# EAGLE schematic MegaShield_v0.6 (EAGLE 6.4)
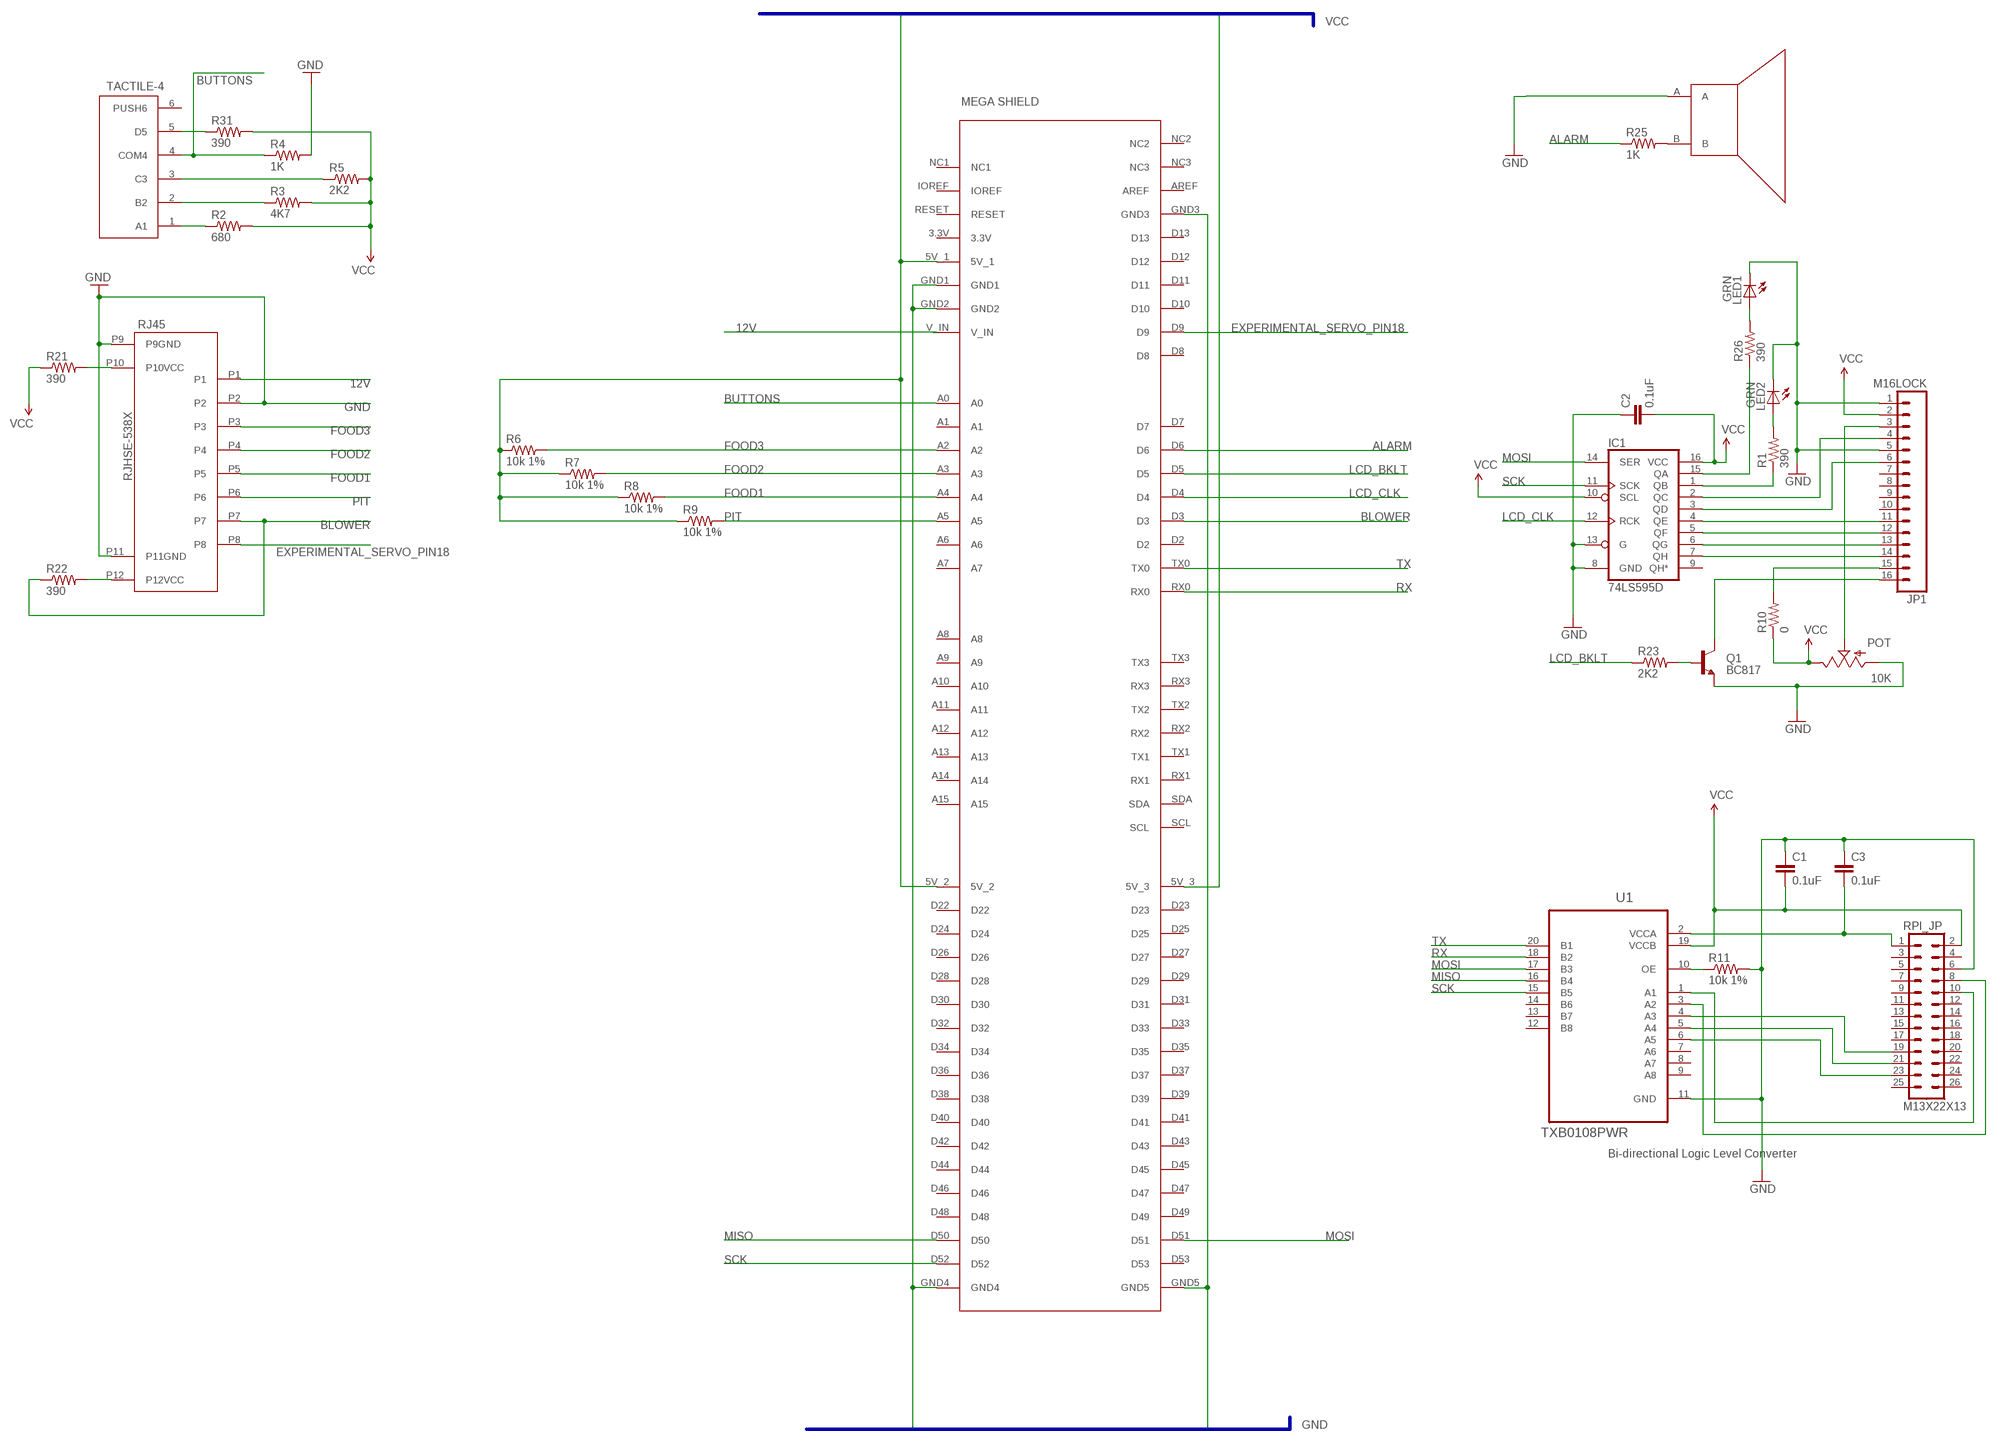
[diagram p0: schematic, sheet 1]

## Parts
C1  0.1uF  CAP0805  [0805]
C2  0.1uF  CAP0805  [0805]
C3  0.1uF  CAP0805  [0805]
IC1  74LS595D  [SO16]
JP1  M16LOCK  [1X16_LOCK]
LED1  GRN  LED5MM  [LED5MM]
LED2  GRN  LED5MM  [LED5MM]
POT  10K  POT100K_3362U  [3362U]
Q1  BC817  TRANSISTOR_NPNSOT23  [SOT23]
R1  390  RESISTOR0805-RES  [0805]
R2  680  RESISTOR0805-RES  [0805]
R3  4K7  RESISTOR0805-RES  [0805]
R4  1K  RESISTOR0805-RES  [0805]
R5  2K2  RESISTOR0805-RES  [0805]
R6  10k 1%  RESISTOR0805-RES  [0805]
R7  10k 1%  RESISTOR0805-RES  [0805]
R8  10k 1%  RESISTOR0805-RES  [0805]
R9  10k 1%  RESISTOR0805-RES  [0805]
R10  0  RESISTOR0805-RES  [0805]
R11  10k 1%  RESISTOR0805-RES  [0805]
R21  390  RESISTOR0805-RES  [0805]
R22  390  RESISTOR0805-RES  [0805]
R23  2K2  RESISTOR0805-RES  [0805]
R25  1K  RESISTOR0805-RES  [0805]
R26  390  RESISTOR0805-RES  [0805]
R31  390  RESISTOR0805-RES  [0805]
RJHSE-538X  RJHSE-338X  [RJHSE-538X]
RPI_JP  M13X22X13  [2X13]
TACTILE-4  SKQUAAA010  [SKQUAAA010]
U1  TXB0108PWR  [SOP65P640X120-20N]
U$1  MEGASHILED  [MEGASHIELD]
U$4  PS1240P02BT  [PS1240P02BT]

## Nets
3.3V_PI: C3.2 RPI_JP.1 U1.2(VCCA)
12V: RJHSE-538X.P1 U$1.V_IN
ALARM: R25.1 U$1.D6
BLOWER: R22.1 RJHSE-538X.P7 U$1.D3
BUTTONS: R4.1 TACTILE-4.4(COM4) U$1.A0
EXPERIMENTAL_SERVO_PIN18: RJHSE-538X.P8 U$1.D9
FOOD1: R8.2 RJHSE-538X.P5 U$1.A4
FOOD2: R7.2 RJHSE-538X.P4 U$1.A3
FOOD3: R6.2 RJHSE-538X.P3 U$1.A2
GND: C1.1 C2.1 C3.1 IC1.8(GND) IC1.13(G) JP1.1 JP1.5 LED1.K(C) LED2.K(C) POT.P$3(A) Q1.2(E) R4.2 R11.2 RJHSE-538X.P2 RJHSE-538X.P9(P9GND) RJHSE-538X.P11(P11GND) RPI_JP.6 U1.11(GND) U$1.GND1 U$1.GND2 U$1.GND3 U$1.GND4 U$1.GND5 U$4.A
LCD_BKLT: R23.1 U$1.D5
LCD_CLK: IC1.12(RCK) U$1.D4
MISO: U1.16(B4) U$1.D50
MOSI: IC1.14(SER) U1.17(B3) U$1.D51
N$1: R22.2 RJHSE-538X.P12(P12VCC)
N$2: R21.2 RJHSE-538X.P10(P10VCC)
N$3: R25.2 U$4.B
N$4: LED2.A R1.2
N$5: IC1.7(QH) JP1.14
N$6: IC1.6(QG) JP1.13
N$7: IC1.5(QF) JP1.12
N$8: R2.1 TACTILE-4.1(A1)
N$9: R3.1 TACTILE-4.2(B2)
N$10: R5.1 TACTILE-4.3(C3)
N$11: R31.1 TACTILE-4.5(D5)
N$12: IC1.4(QE) JP1.11
N$13: IC1.3(QD) JP1.6
N$14: IC1.2(QC) JP1.4
N$15: JP1.15 R10.2
N$16: LED1.A R26.2
N$17: JP1.16 Q1.3(C)
N$18: RPI_JP.10 U1.1(A1)
N$19: JP1.3 POT.P$2(S)
N$21: IC1.15(QA) R26.1
N$22: IC1.1(QB) R1.1
N$23: Q1.1(B) R23.2
N$25: RPI_JP.8 U1.3(A2)
N$26: R11.1 U1.10(OE)
N$27: RPI_JP.19 U1.4(A3)
N$28: RPI_JP.21 U1.5(A4)
N$29: RPI_JP.23 U1.6(A5)
PIT: R9.2 RJHSE-538X.P6 U$1.A5
RX: U1.18(B2) U$1.RX0
SCK: IC1.11(SCK) U1.15(B5) U$1.D52
TX: U1.20(B1) U$1.TX0
VCC: C1.2 C2.2 IC1.10(SCL) IC1.16(VCC) JP1.2 POT.P$1(E) R2.2 R3.2 R5.2 R6.1 R7.1 R8.1 R9.1 R10.1 R21.1 R31.2 RPI_JP.2 U1.19(VCCB) U$1.5V_1 U$1.5V_2 U$1.5V_3
Unconnected: IC1.9(QH*) JP1.7 JP1.8 JP1.9 JP1.10 RPI_JP.3 RPI_JP.4 RPI_JP.5 RPI_JP.7 RPI_JP.9 RPI_JP.11 RPI_JP.12 RPI_JP.13 RPI_JP.14 RPI_JP.15 RPI_JP.16 RPI_JP.17 RPI_JP.18 RPI_JP.20 RPI_JP.22 RPI_JP.24 RPI_JP.25 RPI_JP.26 TACTILE-4.6(PUSH6) U1.7(A6) U1.8(A7) U1.9(A8) U1.12(B8) U1.13(B7) U1.14(B6) U$1.3.3V U$1.A1 U$1.A6 U$1.A7 U$1.A8 U$1.A9 U$1.A10 U$1.A11 U$1.A12 U$1.A13 U$1.A14 U$1.A15 U$1.AREF U$1.D2 U$1.D7 U$1.D8 U$1.D10 U$1.D11 U$1.D12 U$1.D13 U$1.D22 U$1.D23 U$1.D24 U$1.D25 U$1.D26 U$1.D27 U$1.D28 U$1.D29 U$1.D30 U$1.D31 U$1.D32 U$1.D33 U$1.D34 U$1.D35 U$1.D36 U$1.D37 U$1.D38 U$1.D39 U$1.D40 U$1.D41 U$1.D42 U$1.D43 U$1.D44 U$1.D45 U$1.D46 U$1.D47 U$1.D48 U$1.D49 U$1.D53 U$1.IOREF U$1.NC1 U$1.NC2 U$1.NC3 U$1.RESET U$1.RX1 U$1.RX2 U$1.RX3 U$1.SCL U$1.SDA U$1.TX1 U$1.TX2 U$1.TX3

## Buses
GND
VCC

## Library data of the parts
C1 C3 = SparkFun-Passives:CAP: Capacitor Standard 0603 ceramic capacitor, and 0.1" leaded capacitor.
C2 = SparkFun-Capacitors:CAP: Capacitor Standard 0603 ceramic capacitor, and 0.1" leaded capacitor.
IC1 = SparkFun-DigitalIC:74*595: 8-bit SHIFT REGISTER, output latch
JP1 = SparkFun-Connectors:M16: 1x16 .1" header
LED1 LED2 = SparkFun-LED:LED: LEDs Standard schematic elements and footprints for 5mm, 3mm, 1206, and 0603 sized LEDs. 5mm - Spark Fun Electronics SKU : COM-00529 (and others)
POT = SparkFun-Electromechanical:POT
Q1 = SparkFun-DiscreteSemi:TRANSISTOR_NPN: Generic NPN BJT. MMBT2222 is the common NPN we use. Double check against datasheet- not all devices are the same!
R1-R11 R21-R23 R25 R26 R31 = SparkFun-Resistors:RESISTOR: Resistor Basic schematic elements and footprints for 0603, 1206, and PTH resistors.
RJHSE-538X = MyLib:RJHSE-338X; DESCRIPTION: RJ45; PART_NAME: RJHSE-538X
RPI_JP = SparkFun-Connectors:M13X2: 0.1" spaced headers
TACTILE-4 = MyLib:SKQUAAA010; DESCRIPTION: TACTILE-4
U1 = Texas Instruments_By_element14_Batch_1:TXB0108PWR: 8-BIT BIDIRECTIONAL VOLTAGE-LEVEL TRANSLATOR; DESCRIPT: Bi-directional Logic Level Converter; MPN: TXB0108PWR; OC_FARNELL: 1494945; OC_NEWARK: 27M1151; PACKAGE: TSSOP-20; SUPPLIER: Texas Instruments
U$1 = Arduino:MEGASHILED; DESCRIPTION: MEGA SHIELD
U$4 = MyLib:PS1240P02BT